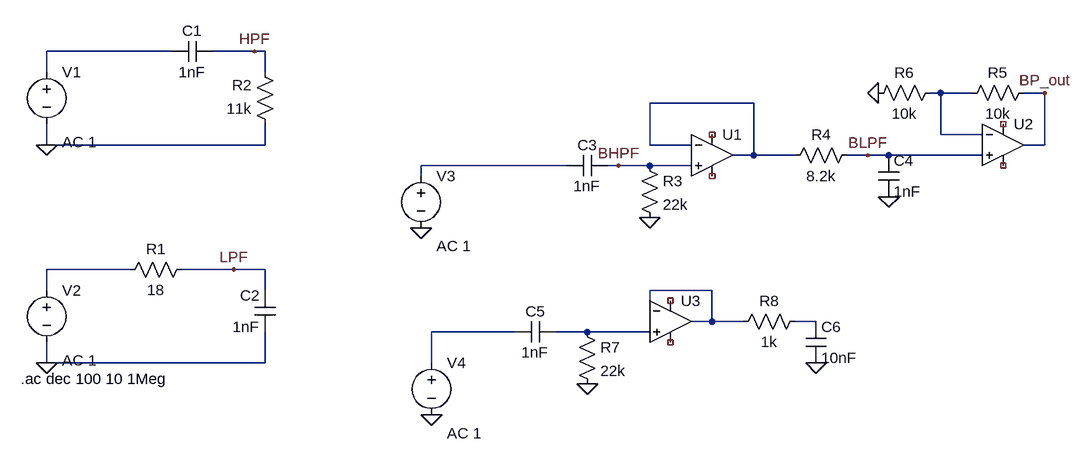
[diagram p0: schematic Draft2.asc]
Draft2.asc, the LTspice schematic file:
Version 4.1
SHEET 1 1800 680
WIRE 256 64 64 64
WIRE 384 64 320 64
WIRE 400 64 384 64
WIRE 64 96 64 64
WIRE 400 96 400 64
WIRE 1440 128 1424 128
WIRE 1488 128 1440 128
WIRE 1600 128 1568 128
WIRE 1152 144 992 144
WIRE 1440 192 1440 128
WIRE 1504 192 1440 192
WIRE 64 208 64 176
WIRE 400 208 400 176
WIRE 400 208 64 208
WIRE 992 208 992 144
WIRE 1056 208 992 208
WIRE 1600 208 1600 128
WIRE 1600 208 1568 208
WIRE 1152 224 1152 144
WIRE 1152 224 1120 224
WIRE 1216 224 1152 224
WIRE 1328 224 1296 224
WIRE 1360 224 1328 224
WIRE 1504 224 1360 224
WIRE 864 240 640 240
WIRE 944 240 928 240
WIRE 992 240 944 240
WIRE 1056 240 992 240
WIRE 640 256 640 240
WIRE 192 400 64 400
WIRE 352 400 272 400
WIRE 400 400 352 400
WIRE 64 432 64 400
WIRE 400 432 400 400
WIRE 1088 432 992 432
WIRE 992 464 992 432
WIRE 1088 480 1088 432
WIRE 1088 480 1056 480
WIRE 1136 480 1088 480
WIRE 1248 480 1216 480
WIRE 784 496 656 496
WIRE 896 496 848 496
WIRE 992 496 896 496
WIRE 64 544 64 512
WIRE 400 544 400 496
WIRE 400 544 64 544
WIRE 656 544 656 496
FLAG 64 208 0
FLAG 64 544 0
FLAG 640 336 0
FLAG 1360 288 0
FLAG 992 320 0
FLAG 944 240 BHPF
FLAG 352 400 LPF
FLAG 384 64 HPF
FLAG 1328 224 BLPF
FLAG 1344 128 0
FLAG 1600 128 BP_out
FLAG 656 624 0
FLAG 1248 544 0
FLAG 896 576 0
SYMBOL voltage 64 80 R0
WINDOW 123 24 124 Left 2
WINDOW 39 0 0 Left 0
SYMATTR Value2 AC 1
SYMATTR InstName V1
SYMATTR Value ""
SYMBOL voltage 64 416 R0
WINDOW 123 24 124 Left 2
WINDOW 39 0 0 Left 0
SYMATTR Value2 AC 1
SYMATTR InstName V2
SYMATTR Value ""
SYMBOL cap 320 48 R90
WINDOW 0 0 32 VBottom 2
WINDOW 3 32 32 VTop 2
SYMATTR InstName C1
SYMATTR Value 1nF
SYMBOL cap 416 496 R180
WINDOW 0 24 56 Left 2
WINDOW 3 24 8 Left 2
SYMATTR InstName C2
SYMATTR Value 1nF
SYMBOL res 288 384 R90
WINDOW 0 0 56 VBottom 2
WINDOW 3 32 56 VTop 2
SYMATTR InstName R1
SYMATTR Value 18
SYMBOL res 416 192 R180
WINDOW 0 36 76 Left 2
WINDOW 3 36 40 Left 2
SYMATTR InstName R2
SYMATTR Value 11k
SYMBOL OpAmps\\UniversalOpAmp 1088 224 R0
SYMATTR InstName U1
SYMBOL voltage 640 240 R0
WINDOW 123 24 124 Left 2
WINDOW 39 0 0 Left 0
SYMATTR Value2 AC 1
SYMATTR InstName V3
SYMATTR Value ""
SYMBOL cap 928 224 R90
WINDOW 0 0 32 VBottom 2
WINDOW 3 32 32 VTop 2
SYMATTR InstName C3
SYMATTR Value 1nF
SYMBOL res 1312 208 R90
WINDOW 0 0 56 VBottom 2
WINDOW 3 32 56 VTop 2
SYMATTR InstName R4
SYMATTR Value 8.2k
SYMBOL cap 1344 224 R0
SYMATTR InstName C4
SYMATTR Value 1nF
SYMBOL res 976 224 R0
SYMATTR InstName R3
SYMATTR Value 22k
SYMBOL OpAmps\\UniversalOpAmp 1536 208 R0
SYMATTR InstName U2
SYMBOL res 1584 112 R90
WINDOW 0 0 56 VBottom 2
WINDOW 3 32 56 VTop 2
SYMATTR InstName R5
SYMATTR Value 10k
SYMBOL res 1440 112 R90
WINDOW 0 0 56 VBottom 2
WINDOW 3 32 56 VTop 2
SYMATTR InstName R6
SYMATTR Value 10k
SYMBOL voltage 656 528 R0
WINDOW 123 24 124 Left 2
WINDOW 39 0 0 Left 0
SYMATTR InstName V4
SYMATTR Value ""
SYMATTR Value2 AC 1
SYMBOL cap 848 480 R90
WINDOW 0 0 32 VBottom 2
WINDOW 3 32 32 VTop 2
SYMATTR InstName C5
SYMATTR Value 1nF
SYMBOL res 880 480 R0
SYMATTR InstName R7
SYMATTR Value 22k
SYMBOL OpAmps\\UniversalOpAmp 1024 480 R0
SYMATTR InstName U3
SYMBOL res 1232 464 R90
WINDOW 0 0 56 VBottom 2
WINDOW 3 32 56 VTop 2
SYMATTR InstName R8
SYMATTR Value 1k
SYMBOL cap 1232 480 R0
SYMATTR InstName C6
SYMATTR Value 10nF
TEXT 24 568 Left 2 !.ac dec 100 10 1Meg

The netlist it stands for:
* Draft2.asc
V1 N001 0 AC 1
V2 N005 0 AC 1
C1 HPF N001 1nF
C2 0 LPF 1nF
R1 LPF N005 18
R2 0 HPF 11k
X§U1 BHPF N003 NC_01 NC_02 N003 level1 Avol=1Meg GBW=10Meg Vos=0 En=0 Enk=0 In=0 Ink=0 Rin=500Meg  ; pins In+ In- V+ V- OUT
V3 N004 0 AC 1
C3 BHPF N004 1nF
R4 BLPF N003 8.2k
C4 BLPF 0 1nF
R3 BHPF 0 22k
X§U2 BLPF N002 NC_03 NC_04 BP_out level1 Avol=1Meg GBW=10Meg Vos=0 En=0 Enk=0 In=0 Ink=0 Rin=500Meg  ; pins In+ In- V+ V- OUT
R5 BP_out N002 10k
R6 N002 0 10k
V4 N008 0 AC 1
C5 N009 N008 1nF
R7 N009 0 22k
X§U3 N009 N006 NC_05 NC_06 N006 level1 Avol=1Meg GBW=10Meg Vos=0 En=0 Enk=0 In=0 Ink=0 Rin=500Meg  ; pins In+ In- V+ V- OUT
R8 N007 N006 1k
C6 N007 0 10nF
.ac dec 100 10 1Meg
.lib UniversalOpAmp1.lib
.backanno
.end